# Altium project NRF52832_Smart_shoe.PrjPcb
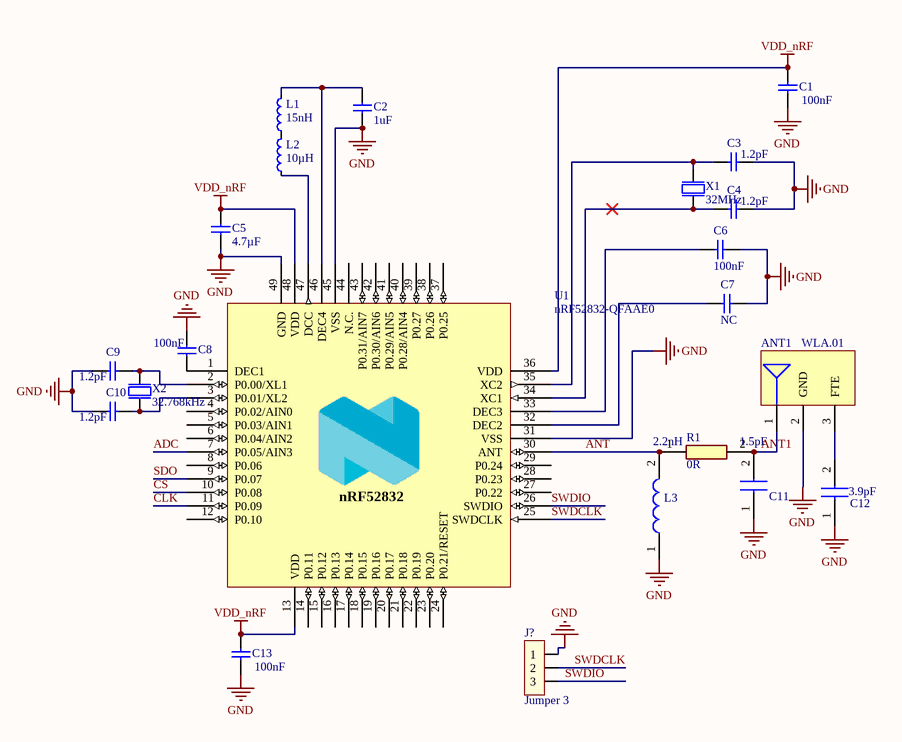
[diagram p0: Smart shoe_MCU.SchDoc]
3 sheets, 36 parts. Net scope: global (net labels, ports and power ports of the same name join across sheets).
Board file: Smart shoe.PcbDoc
Sheets:
  Smart shoe_MCU.SchDoc
  Smart shoe_Power.SchDoc
  Smart shoe_Sensor.SchDoc

## Sheet Smart shoe_MCU.SchDoc
size A; SheetNumber: 1; SheetTotal: 3

### Parts
ANT1  WLA.01  [TAOGLAS_WLA.01]
C1  100nF  [CAPC1005X04L]
C2  1uF  [CAPC1608X06L]
C3  1.2pF  [CAPC1005X55N]
C4  1.2pF  [CAPC1005X55N]
C5  4.7µF  [CAPC1608X06L]
C6  100nF  [CAPC1005X04L]
C7  NC  [CAPC1005X55N]
C8  100nF  [CAPC1005X04L]
C9  1.2pF  [CAPC1005X04L]
C10  1.2pF  [CAPC1005X04L]
C11  1.5pF  [CAPC1005X55N]
C12  3.9pF  [CAPC1005X55N]
C13  100nF  [CAPC1005X55N]
J?  Jumper 3  [JP3]
L1  15nH  [INDC1005X04L]
L2  10µH  [INDC1608X06L]
L3  2.2nH  [INDC1005X60N]
R1  0R  [RESC1005X40N]
U1  nRF52832-QFAAE0  [QFN40P600X600X90-48N]
X1  32MHz  [BT-XTAL_2016]
X2  32.768kHz  [XTAL_3215]

### Nets
GND: ANT1.2(GND) C1.1 C2.1 C3.1 C4.1 C5.2 C6.1 C7.1 C8.2 C9.1 C10.1 C11.1 C12.1 C13.1 J?.1 L3.1 U1.31(VSS) U1.45(VSS) U1.49(GND) X1.2(GND) X1.4(GND)
VDD_nRF: C1.2 C5.1 C13.2 U1.13(VDD) U1.36(VDD) U1.48(VDD)
ADC: U1.7(P0.05/AIN3)
ANT: L3.2 R1.1 U1.30(ANT)
ANT1: ANT1.1(RF_OUT) C11.2 R1.2
CLK: U1.11(P0.09)
CS: U1.10(P0.08)
SDO: U1.9(P0.07)
SWDCLK: J?.2 U1.25(SWDCLK)
SWDIO: J?.3 U1.26(SWDIO)
NetANT1_3: ANT1.3(FTE) C12.2
NetC2_2: C2.2 L1.2 U1.46(DEC4)
NetC3_2: C3.2 U1.35(XC2) X1.3(out)
NetC4_2: C4.2 U1.34(XC1) X1.1(inp)
NetC6_2: C6.2 U1.33(DEC3)
NetC7_2: C7.2 U1.32(DEC2)
NetC8_1: C8.1 U1.1(DEC1)
NetC9_2: C9.2 U1.2(P0.00/XL1) X2.2(out)
NetC10_2: C10.2 U1.3(P0.01/XL2) X2.1(inp)
NetL1_1: L1.1 L2.2
NetL2_1: L2.1 U1.47(DCC)

Not connected (* = marked no-connect by the designer): U1 4(P0.02/AIN0) 5(P0.03/AIN1) 6(P0.04/AIN2) 8(P0.06) 12(P0.10) 14(P0.11) 15(P0.12) 16(P0.13) 17(P0.14) 18(P0.15) 19(P0.16) 20(P0.17) 21(P0.18) 22(P0.19) 23(P0.20) 24(P0.21/RESET) 27(P0.22) 28(P0.23) 29(P0.24) 37(P0.25) 38(P0.26) 39(P0.27) 40(P0.28/AIN4) 41(P0.29/AIN5) 42(P0.30/AIN6) 43(P0.31/AIN7) 44(N.C.)

### Notes on the sheet
- (in symbol nRF52832_QFAA) nRF52832

### Library data of the parts
ANT1 = TAOGLAS_WLA.01: 2.5dBi 240 0MHz to 250MHz WLAN/WIFI/Bluetooth/Zigbee; ComponentLibStatus: Created; Temp_High: +85C; Temp_Low: -40C; Datasheet: http://cdn.taoglas.com/datasheets/WLA.01.pdf; FootprintLibStatus: Created; MFG: Taoglas; MFGPN: WLA.01; RoHS: RoHS Compliant; Version: 1.0
C1 C6-C8 C13 = CAP_0402: Capacitor, NP0, ±0.1pF; Part Number: C0402-1.2p; Part number IPS: 00000005410; Value: 1.2pF; Note: 50V; Artikkelnr Noca: 20029157; Artikkelnr Simpro: N.A.; Manufacturer: *; Manufacturer Part Number: *; Datasheet: *; LatestRevisionDate: 2011-05-11; Pin Count: 2; Publisher: Nordic Semiconductor; Published: 2009-05-08; Supplier: *; Supplier part number: *; 2nd source Supplier: *; 2nd source part number: *; Footprint Doc: 0402
C2 = CAP_0603: Capacitor, X5R, ±10%; Part Number: C0603-4µ7; Part number IPS: 00000007783; Value: 4.7µF; Note: 6.3V; Artikkelnr Noca: 20069060; Artikkelnr Simpro: N.A.; Manufacturer: *; Manufacturer Part Number: *; Datasheet: *; LatestRevisionDate: 2009-11-23; Pin Count: 2; Publisher: Nordic Semiconductor; Published: 2009-05-08; Supplier: *; Supplier part number: *; 2nd source Supplier: *; 2nd source part number: *; Footprint Doc: 0603
C3 C4 C9 C10 = CAP_0402: Capacitor, NP0, ±0.1pF; Part Number: C0402-1.2p; Part number IPS: 00000005410; Note: 50V; Artikkelnr Noca: 20029157; Artikkelnr Simpro: N.A.; Manufacturer: *; Manufacturer Part Number: *; Datasheet: *; LatestRevisionDate: 2011-05-11; Pin Count: 2; Publisher: Nordic Semiconductor; Published: 2009-05-08; Value: 1.2pF; Supplier: *; Supplier part number: *; 2nd source Supplier: *; 2nd source part number: *; Footprint Doc: 0402
C5 = CAP_0603: Capacitor, X5R, ±10%; Part Number: C0603-4µ7; Part number IPS: 00000007783; Note: 6.3V; Artikkelnr Noca: 20069060; Artikkelnr Simpro: N.A.; Manufacturer: *; Manufacturer Part Number: *; Datasheet: *; LatestRevisionDate: 2009-11-23; Pin Count: 2; Publisher: Nordic Semiconductor; Published: 2009-05-08; Value: 4.7µF; Supplier: *; Supplier part number: *; 2nd source Supplier: *; 2nd source part number: *; Footprint Doc: 0603
C11 = GRM1555C1H3R9CA01D: Capacitor; Manufacturer_Name: Murata Electronics; Datasheet Link: https://datasheet.datasheetarchive.com/originals/distributors/Datasheets_SAMA/ec4f1577dddcc7a13ddad897a28002d3.pdf; Height: 0.55mm; Manufacturer_Part_Number: GRM1555C1H3R9CA01D; Mouser Part Number: 81-GRM1555C1H3R9CA1D; Mouser Price/Stock: https://www.mouser.co.uk/ProductDetail/Murata-Electronics/GRM1555C1H3R9CA01D?qs=4k9rjS6ZRl60G7lbEFmGRg%3D%3D; Arrow Part Number: GRM1555C1H3R9CA01D; Arrow Price/Stock: https://www.arrow.com/en/products/grm1555c1h3r9ca01d/murata-manufacturing
C12 = GRM1555C1H1R5CA01D: Capacitor; Manufacturer_Name: Murata Electronics; Datasheet Link: https://datasheet.datasheetarchive.com/originals/distributors/Datasheets_SAMA/ec4f1577dddcc7a13ddad897a28002d3.pdf; Height: 0.55mm; Manufacturer_Part_Number: GRM1555C1H1R5CA01D; Mouser Part Number: 81-GRM1555C1H1R5CA1D; Mouser Price/Stock: https://www.mouser.co.uk/ProductDetail/Murata-Electronics/GRM1555C1H1R5CA01D?qs=to8XolpOzrMkK3a3HyCgMg%3D%3D; Arrow Part Number: GRM1555C1H1R5CA01D; Arrow Price/Stock: https://www.arrow.com/en/products/grm1555c1h1r5ca01d/murata-manufacturing
J? = JP3: Value: J3
L1 = IND_0402: Inductor, 320mA, ±5%; Part Number: L0402-15n; Manufacturer: Taiyo Yuden; Manufacturer Part Number: HK100515NJ-T; 2nd source part number: 658-1328; Part number IPS: 00000003215; Note: High frequency chip inductor ±10%; Artikkelnr Noca: 33029323; Artikkelnr Simpro: N.A.; LatestRevisionDate: 2012-09-19; Pin Count: 2; Publisher: Nordic Semiconductor; Published: 2010-07-12; Value: 15nH; Supplier: Digi-Key; Datasheet: http://www.yuden.co.jp/productdata/catalog/en/mlci04_e.pdf; Supplier part number: 587-1521-1-ND; 2nd source Supplier: Farnell; Footprint Doc: 0402; ComponentLink1Description: Datasheet; ComponentLink2Description: Supplier link
L2 = IND_0603: Inductor, 80mA, ±10%; Part Number: L0603-10µ; Manufacturer: Taiyo Yuden; Manufacturer Part Number: LBMF1608T100K; 2nd source part number: 178-6105; Part number IPS: 00000007794; Note: LBMF1608T100K 10µH 80mA 0603; Artikkelnr Noca: 33029314; Artikkelnr Simpro: N.A.; Datasheet: http://www.yuden.co.jp/ut/product/pdf/elb2_e.pdf; LatestRevisionDate: 2012-09-19; Pin Count: 2; Publisher: Nordic Semiconductor; Published: 2010-02-24; Value: 10µH; Supplier: Digi-Key; Supplier part number: 587-1714-1-ND; 2nd source Supplier: Farnell; Footprint Doc: 0603; ComponentLink1Description: Datasheet; ComponentLink2Description: Supplier link
L3 = MLK1005S2N2ST000: Inductor; Manufacturer_Name: TDK; Datasheet Link: https://product.tdk.com/system/files/dam/doc/product/inductor/inductor/smd/catalog/inductor_commercial_high-frequency_mlk1005_en.pdf; Height: 0.6mm; Manufacturer_Part_Number: MLK1005S2N2ST000; Mouser Part Number: 810-MLK1005S2N2ST000; Mouser Price/Stock: https://www.mouser.com/Search/Refine.aspx?Keyword=810-MLK1005S2N2ST000; Arrow Part Number: MLK1005S2N2ST000; Arrow Price/Stock: https://www.arrow.com/en/products/mlk1005s2n2st000/tdk
R1 = RC0402FR070RL: Resistor; Manufacturer_Name: YAGEO (PHYCOMP); Height: 0.4mm; Manufacturer_Part_Number: RC0402FR070RL
U1 = nRF52832_QFAA: Multi-protocol Bluetooth Low Energy, ANT and 2.4GHz proprietary system-on-chip; Manufacturer: Nordic Semiconductor; Artikkelnr Noca: N.A.; Part Number: nRF52832-QFAAE0; Manufacturer Part Number: nRF52832-QFAAE0; LatestRevisionDate: 2017-10-18; Pin Count: 48; Publisher: Nordic Semiconductor; Published: 2017-10-18; Value: nRF52832-QFAAE0; Note: *; Footprint Doc: QFN-48; Part number IPS: N.A.; ComponentLink1URL: *; ComponentLink1Description: Datasheet; ComponentLink2URL: *; ComponentLink2Description: Supplier link; HelpURL: *; Supplier 1: Nordic Semiconductor; Supplier Part Number 1: nRF52832-QFAAE0; Supplier 2: *; Supplier Part Number 2: *
X1 = XTAL_2016: XTAL SMD 2016, 32MHz, Cl=8pF, Tol: ±10ppm, Stab: ±10ppm; Part Number: XTAL_SMD2016_32MHz_8pF_Epson; Manufacturer: Epson Toyocom; Manufacturer Part Number: Q22FA12800025; Note: XTAL SMD 32.000MHz; Artikkelnr Noca: 22019238; Artikkelnr Simpro: N.A.; Datasheet: http://www.epsondevice.com/docs/qd/en/DownloadServlet?id=ID000449; LatestRevisionDate: 2014-11-27; Pin Count: 4; Publisher: Nordic Semiconductor; Published: 2012-03-09; Value: 32MHz; Supplier: Farnell; Supplier part number: 171-2806; 2nd source Supplier: *; 2nd source part number: *; Footprint Doc: XTAL_2016
X2 = XTAL_3215: XTAL SMD 3215, 32.768kHz, 9pF, ±20ppm; Part Number: XTAL_FC-135 32.768k; Manufacturer: Epson Toyocom; Manufacturer Part Number: FC-135 32.768KHZ ±20PPM,9.0PF; 2nd source part number: 127-8037; Note: XTAL SMD 32.768kHz, 3215; Artikkelnr Noca: 22019091; Artikkelnr Simpro: N.A.; Datasheet: http://www.farnell.com/datasheets/57480.pdf; LatestRevisionDate: 2014-03-27; Pin Count: 2; Publisher: Nordic Semiconductor; Published: 2010-10-18; Value: 32.768kHz; Supplier: Digi-Key; Supplier part number: FC-135 32.7680KA-AC-ND; 2nd source Supplier: Farnell; Footprint Doc: XTAL_3215

## Sheet Smart shoe_Power.SchDoc
size A; SheetNumber: 2; SheetTotal: 3
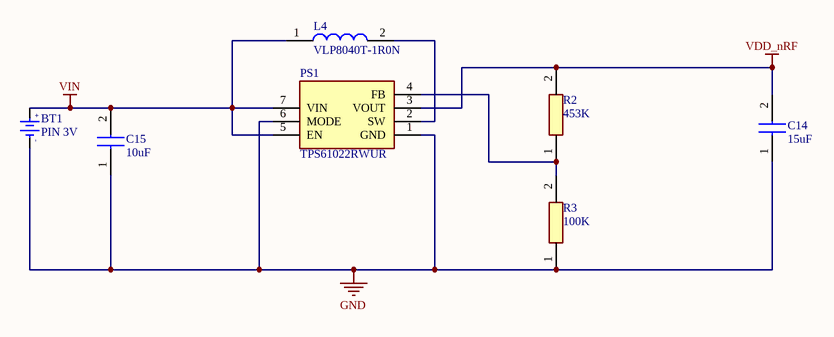
[diagram p1: Smart shoe_Power.SchDoc]

### Parts
BT1  PIN 3V  [PIN3V]
C14  15uF  [CAPC2012X145N]
C15  10uF  [CAPC2012X145N]
L4  VLP8040T-1R0N  [VLP8040T_1]
PS1  TPS61022RWUR  [TPS61022RWUR]
R2  453K  [RESC1005X40N]
R3  100K  [RESC1005X40N]

### Nets
GND: BT1.2(GND) C14.1 C15.1 PS1.1(GND) PS1.6(MODE) R3.1
VDD_nRF: C14.2 PS1.3(VOUT) R2.2
VIN: BT1.1(+3V) C15.2 L4.1 PS1.5(EN) PS1.7(VIN)
NetL4_2: L4.2 PS1.2(SW)
NetPS1_4: PS1.4(FB) R2.1 R3.2

### Notes on the sheet
- (in symbol PIN 3V) +; -

### Library data of the parts
BT1 = PIN 3V: Battery 3VDC; Value: PIN 3V
C14 = C2012X5R1V156M125AC: Capacitor; Manufacturer_Name: TDK; Datasheet Link: https://product.tdk.com/en/search/list#pn=C1608C0G1E103J080AA&site=FBNXDO0R&charset=UTF-8&group=tdk_pdc_en&design=producttdkcom-en&fromsyncsearch=1&_l=20&_p=1&_c=part_no-part_no&_d=667; Height: 0.75mm; Manufacturer_Part_Number: C2012X5R1V156M125AC; Mouser Part Number: 810-C2012X5R1V156M1C; Mouser Price/Stock: https://www.mouser.co.uk/ProductDetail/TDK/C2012X5R1V156M125AC?qs=xLDY6iXSiQZGpZ5eDP6b8w%3D%3D; Arrow Part Number: C2012X5R1V156M125AC; Arrow Price/Stock: https://www.arrow.com/en/products/c2012x5r1v156m125ac/tdk?region=nac
C15 = C0805C106K8PACTU: Capacitor; Manufacturer_Name: Kemet; Datasheet Link: https://www.arrow.com/en/products/c0805c106k8pactu/kemet-corporation; Height: 1.4mm; Manufacturer_Part_Number: C0805C106K8PACTU; Mouser Part Number: 80-C0805C106K8P; Mouser Price/Stock: https://www.mouser.co.uk/ProductDetail/KEMET/C0805C106K8PACTU?qs=Zpyg6gQUYs39C21BeavaKA%3D%3D; Arrow Part Number: C0805C106K8PACTU; Arrow Price/Stock: https://www.arrow.com/en/products/c0805c106k8pactu/kemet-corporation
L4 = VLP8040T-1R0N: Inductor; Manufacturer_Name: TDK; Datasheet Link: http://www.mouser.com/ds/2/400/nductor_commercial_power_vlp8040_en-952627.pdf; Manufacturer_Part_Number: VLP8040T-1R0N; Mouser Part Number: 810-VLP8040T-1R0N; Mouser Price/Stock: https://www.mouser.co.uk/ProductDetail/TDK/VLP8040T-1R0N?qs=uxmvvYJjMIuWRhSk5I768Q%3D%3D; Arrow Part Number: VLP8040T-1R0N; Arrow Price/Stock: https://www.arrow.com/en/products/vlp8040t-1r0n/tdk
PS1 = TPS61022RWUR: Power Supply; Manufacturer_Name: Texas Instruments; Datasheet Link: http://www.ti.com/lit/gpn/TPS61022; Height: 1mm; Manufacturer_Part_Number: TPS61022RWUR; Mouser Part Number: 595-TPS61022RWUR; Mouser Price/Stock: https://www.mouser.co.uk/ProductDetail/Texas-Instruments/TPS61022RWUR?qs=vLWxofP3U2zlxrk4cD0iFA%3D%3D; Arrow Part Number: TPS61022RWUR; Arrow Price/Stock: https://www.arrow.com/en/products/tps61022rwur/texas-instruments?region=nac
R2 = CRCW0402453KFKED: Resistor; Manufacturer_Name: Vishay; Datasheet Link: http://www.vishay.com/docs/20035/dcrcwe3.pdf; Height: 0.4mm; Manufacturer_Part_Number: CRCW0402453KFKED; Mouser Part Number: 71-CRCW0402-453K-E3; Mouser Price/Stock: https://www.mouser.co.uk/ProductDetail/Vishay-Dale/CRCW0402453KFKED?qs=rzhQWu8UUS1a9YBNTq1G%2FA%3D%3D; Arrow Part Number: CRCW0402453KFKED; Arrow Price/Stock: https://www.arrow.com/en/products/crcw0402453kfked/vishay
R3 = CRCW0402100KFKEDHP: Resistor; Manufacturer_Name: Vishay; Datasheet Link: http://www.vishay.com/docs/20035/dcrcwe3.pdf; Height: 0.4mm; Manufacturer_Part_Number: CRCW0402100KFKEDHP; Mouser Part Number: 71-CRCW0402100KFKEDH; Mouser Price/Stock: https://www.mouser.co.uk/ProductDetail/Vishay-Dale/CRCW0402100KFKEDHP?qs=k2%2FDWSARqgGFakjlJe4Ejw%3D%3D; Arrow Part Number: CRCW0402100KFKEDHP; Arrow Price/Stock: https://www.arrow.com/en/products/crcw0402100kfkedhp/vishay?region=nac

## Sheet Smart shoe_Sensor.SchDoc
size A; SheetNumber: 3; SheetTotal: 3
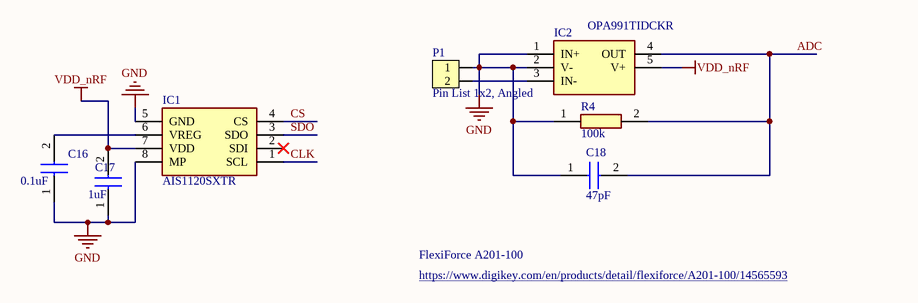
[diagram p2: Smart shoe_Sensor.SchDoc]

### Parts
C16  0.1uF  [CAPC0603X03L_C]
C17  1uF  [CAPC0603X33N]
C18  47pF  [CAPC1005X56N]
IC1  AIS1120SXTR  [SOIC127P600X175-8N]
IC2  OPA991TIDCKR  [SOT65P210X110-5N]
P1  Pin List 1x2, Angled  [LIST_ANG_1x2-SMD-2.54MM]
R4  100k  [RESC0402X15N]

### Nets
GND: C16.1 C17.1 C18.1 IC1.5(GND) IC1.8(MP) IC2.1(IN+) IC2.2(V-) P1.1 R4.1
VDD_nRF: C17.2 IC1.7(VDD) IC2.5(V+)
ADC: C18.2 IC2.4(OUT) R4.2
CLK: IC1.1(SCL)
CS: IC1.4(CS)
SDO: IC1.3(SDO)
NetC16_2: C16.2 IC1.6(VREG)
NetIC2_3: IC2.3(IN-) P1.2

Not connected (* = marked no-connect by the designer): IC1 2(SDI)*

### Notes on the sheet
- FlexiForce A201-100
- https://www.digikey.com/en/products/detail/flexiforce/A201-100/14565593

### Library data of the parts
C16 = C0603X7S1A104K030BC: Capacitor; Manufacturer_Name: TDK; Datasheet Link: https://product.tdk.com/system/files/dam/doc/product/capacitor/ceramic/mlcc/catalog/mlcc_commercial_general_en.pdf; Height: 0.33mm; Manufacturer_Part_Number: C0603X7S1A104K030BC; Mouser Part Number: 810-C0603X7S1A104K; Mouser Price/Stock: https://www.mouser.com/Search/Refine.aspx?Keyword=810-C0603X7S1A104K
C17 = GRM033R61A105ME15E: Capacitor; Manufacturer_Name: Murata Electronics; Datasheet Link: https://datasheet.datasheetarchive.com/originals/distributors/DKDS-10/190794.pdf; Height: 0.33mm; Manufacturer_Part_Number: GRM033R61A105ME15E; Mouser Part Number: 81-GRM033R61A105ME5E; Mouser Price/Stock: https://www.mouser.co.uk/ProductDetail/Murata-Electronics/GRM033R61A105ME15E?qs=BZBei1rCqCCF%2FCkYfqSFSg%3D%3D
C18 = 0402ZA470JAT2A: Capacitor; Manufacturer_Name: AVX; Height: 0.56mm; Manufacturer_Part_Number: 0402ZA470JAT2A
IC1 = AIS1120SXTR: Integrated Circuit; Manufacturer_Name: STMicroelectronics; Datasheet Link: https://www.st.com/resource/en/datasheet/ais1120sx.pdf; Height: 1.75mm; Manufacturer_Part_Number: AIS1120SXTR; Mouser Part Number: 511-AIS1120SXTR; Mouser Price/Stock: https://www.mouser.co.uk/ProductDetail/STMicroelectronics/AIS1120SXTR?qs=BA62vJVifGoAj%2Fv2Aa%252BKHA%3D%3D; Arrow Part Number: AIS1120SXTR; Arrow Price/Stock: https://www.arrow.com/en/products/ais1120sxtr/stmicroelectronics?region=nac
IC2 = OPA991TIDCKR: Integrated Circuit; Manufacturer_Name: Texas Instruments; Datasheet Link: https://www.ti.com/lit/ds/symlink/opa991.pdf?ts=1634650356786&ref_url=https%253A%252F%252Feu.mouser.com%252F; Height: 1.1mm; Manufacturer_Part_Number: OPA991TIDCKR; Mouser Part Number: 595-OPA991TIDCKR; Mouser Price/Stock: https://www.mouser.co.uk/ProductDetail/Texas-Instruments/OPA991TIDCKR?qs=Wj%2FVkw3K%252BMD%2FIzu2Yv2xzw%3D%3D
P1 = LIST-1x2_ANG: Pin List 1x2, 2.54mm (100mil), Right Angled, SMD; Part Number: Pin List Ang 1x2 SMD, 2.54mm; Manufacturer: W-CON; Manufacturer Part Number: 1125B-1102S0Z135R2; 2nd source part number: TSM-102-01-L-SH-A; Artikkelnr Noca: 55010023; Artikkelnr Simpro: N.A.; Datasheet: \\hizz\pro\app9717\Datasheet\connectores\W-CON\1125B-11XXXXZXXXXX.pdf; Footprint Doc: LIST_ANG_1x2-SMD-2.54MM; LatestRevisionDate: 2016-05-26; Pin Count: 2; Publisher: Nordic Semiconductor; Published: 2016-01-22; Value: Pin List 1x2, Angled; Note: *; Supplier: Cabcon; Supplier part number: 1125B-1102S0Z135R2; 2nd source Supplier: Samtec
R4 = CRCW0100100KFREL: Resistor; Manufacturer_Name: Vishay; Datasheet Link: https://www.mouser.com/datasheet/2/427/crcw01005e3-1149660.pdf; Height: 0.15mm; Manufacturer_Part_Number: CRCW0100100KFREL; Mouser Part Number: 71-CRCW0100100KFREL; Mouser Price/Stock: https://www.mouser.co.uk/ProductDetail/Vishay-Dale/CRCW0100100KFREL?qs=3CaSHoNeR5u3JhUOs4PYBg%3D%3D; Arrow Part Number: CRCW0100100KFREL; Arrow Price/Stock: https://www.arrow.com/en/products/crcw0100100kfrel/vishay?region=nac

## Nets that join several sheets
GND: Smart shoe_MCU (21 pins), Smart shoe_Power (6 pins), Smart shoe_Sensor (9 pins)
VDD_nRF: Smart shoe_MCU (6 pins), Smart shoe_Power (C14.2 PS1.3 R2.2), Smart shoe_Sensor (C17.2 IC1.7 IC2.5)
ADC: Smart shoe_MCU (U1.7), Smart shoe_Sensor (C18.2 IC2.4 R4.2)
CLK: Smart shoe_MCU (U1.11), Smart shoe_Sensor (IC1.1)
CS: Smart shoe_MCU (U1.10), Smart shoe_Sensor (IC1.4)
SDO: Smart shoe_MCU (U1.9), Smart shoe_Sensor (IC1.3)